# EAGLE design NIBB (EAGLE 8.1.0)
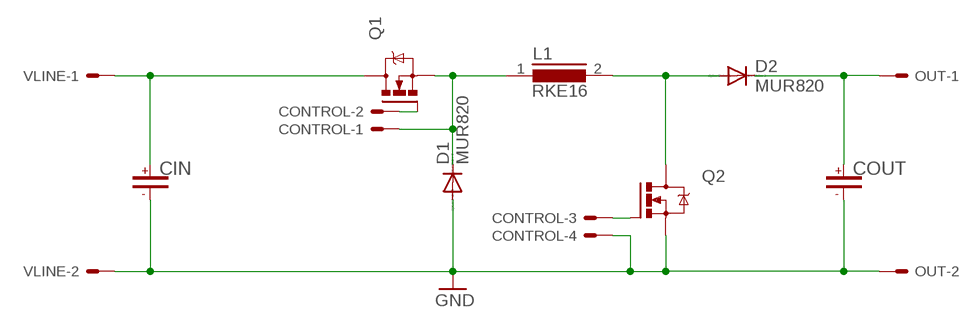
[diagram p0: schematic, sheet 1]

## Parts
CIN  CAPP-UF  [20ROUND40P]
CONTROL  22-23-2041  [22-23-2041]
COUT  CAPP-UF  [20ROUND40P]
D1  MUR820  [C221B1A]
D2  MUR820  [C221B1A]
L1  RKE16  [RKE16]
OUT  22-23-2021  [22-23-2021]
Q1  IRF640  [TO220BV]
Q2  IRF640  [TO220BV]
VLINE  22-23-2021  [22-23-2021]

## Nets
GND: CIN.- CONTROL.4 COUT.- D1.A OUT.2 Q2.S VLINE.2
N$1: CONTROL.1 D1.C L1.1 Q1.S
N$2: D2.A L1.2 Q2.D
N$3: CIN.+ Q1.D VLINE.1
N$4: CONTROL.2 Q1.G
N$5: CONTROL.3 Q2.G
N$7: COUT.+ D2.C OUT.1

## Library data of the parts
CIN COUT = capacitor:CAPP-U: Polarized capacitor, positive up; DESC: Capacitor, polarized
CONTROL = con-molex:22-23-2041: .100" (2.54mm) Center Header - 4 Pin; MF: MOLEX; MPN: 22-23-2041; OC_FARNELL: 1462920; OC_NEWARK: 38C0355
D1 D2 = diode:MUR820: DIODE
L1 = inductors:RKE16: INDUCTOR
OUT VLINE = con-molex:22-23-2021: .100" (2.54mm) Center Header - 2 Pin; MF: MOLEX; MPN: 22-23-2021; OC_FARNELL: 1462926; OC_NEWARK: 25C3832
Q1 Q2 = felippe:IRF640

## Board
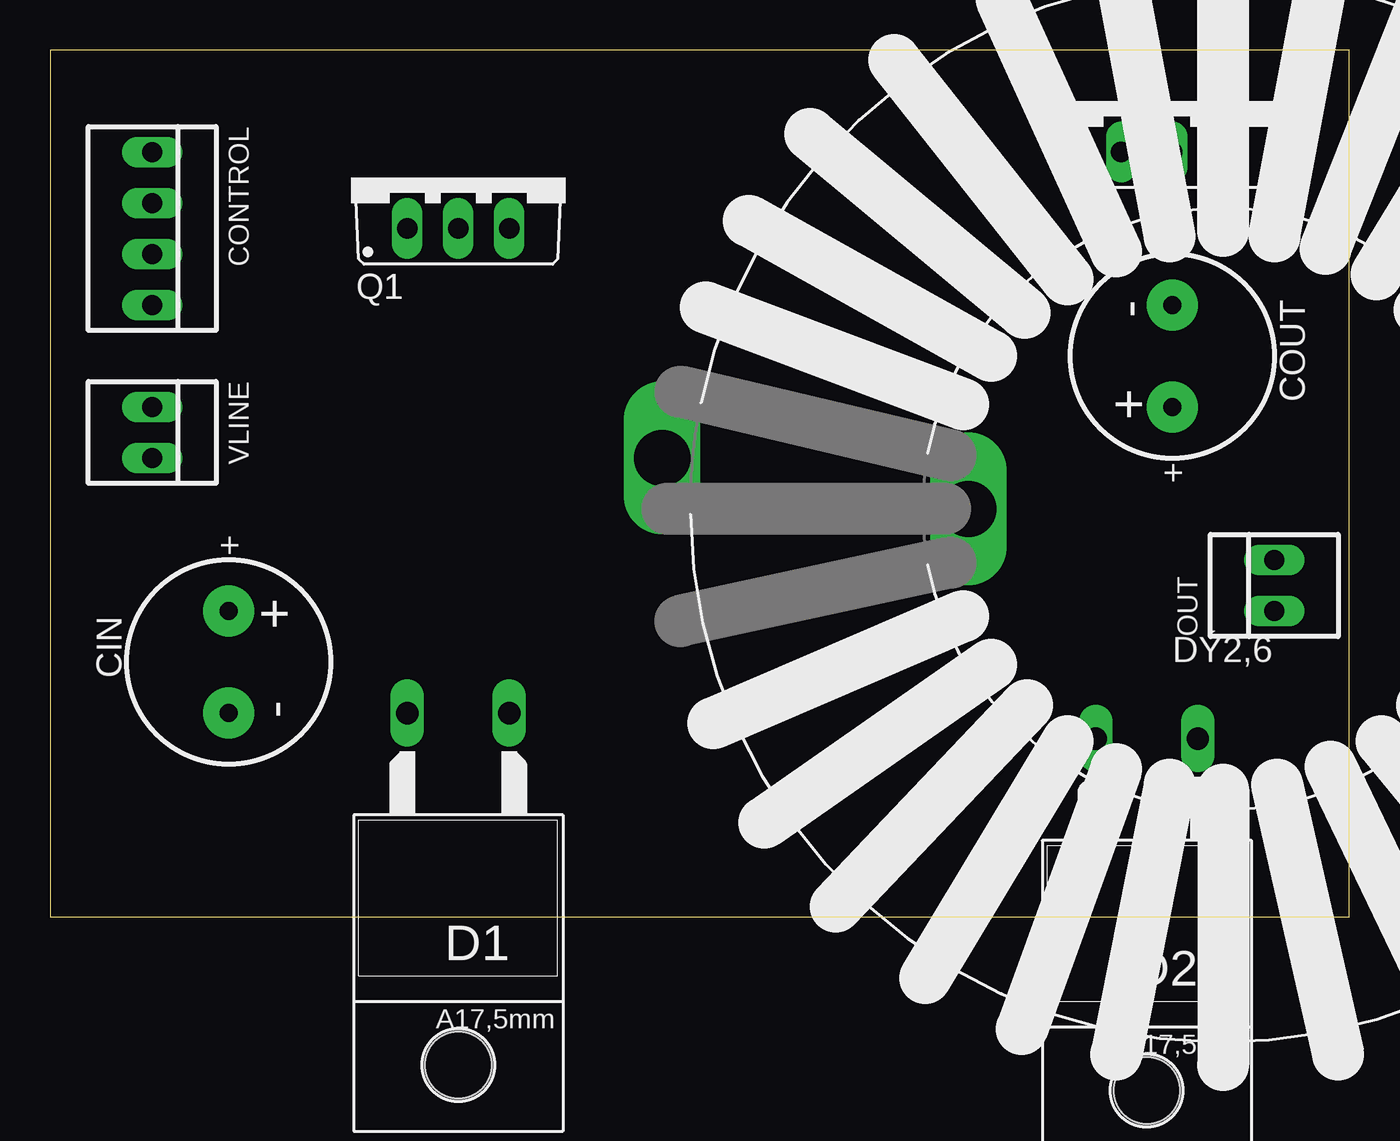
[diagram p1: board, top side]
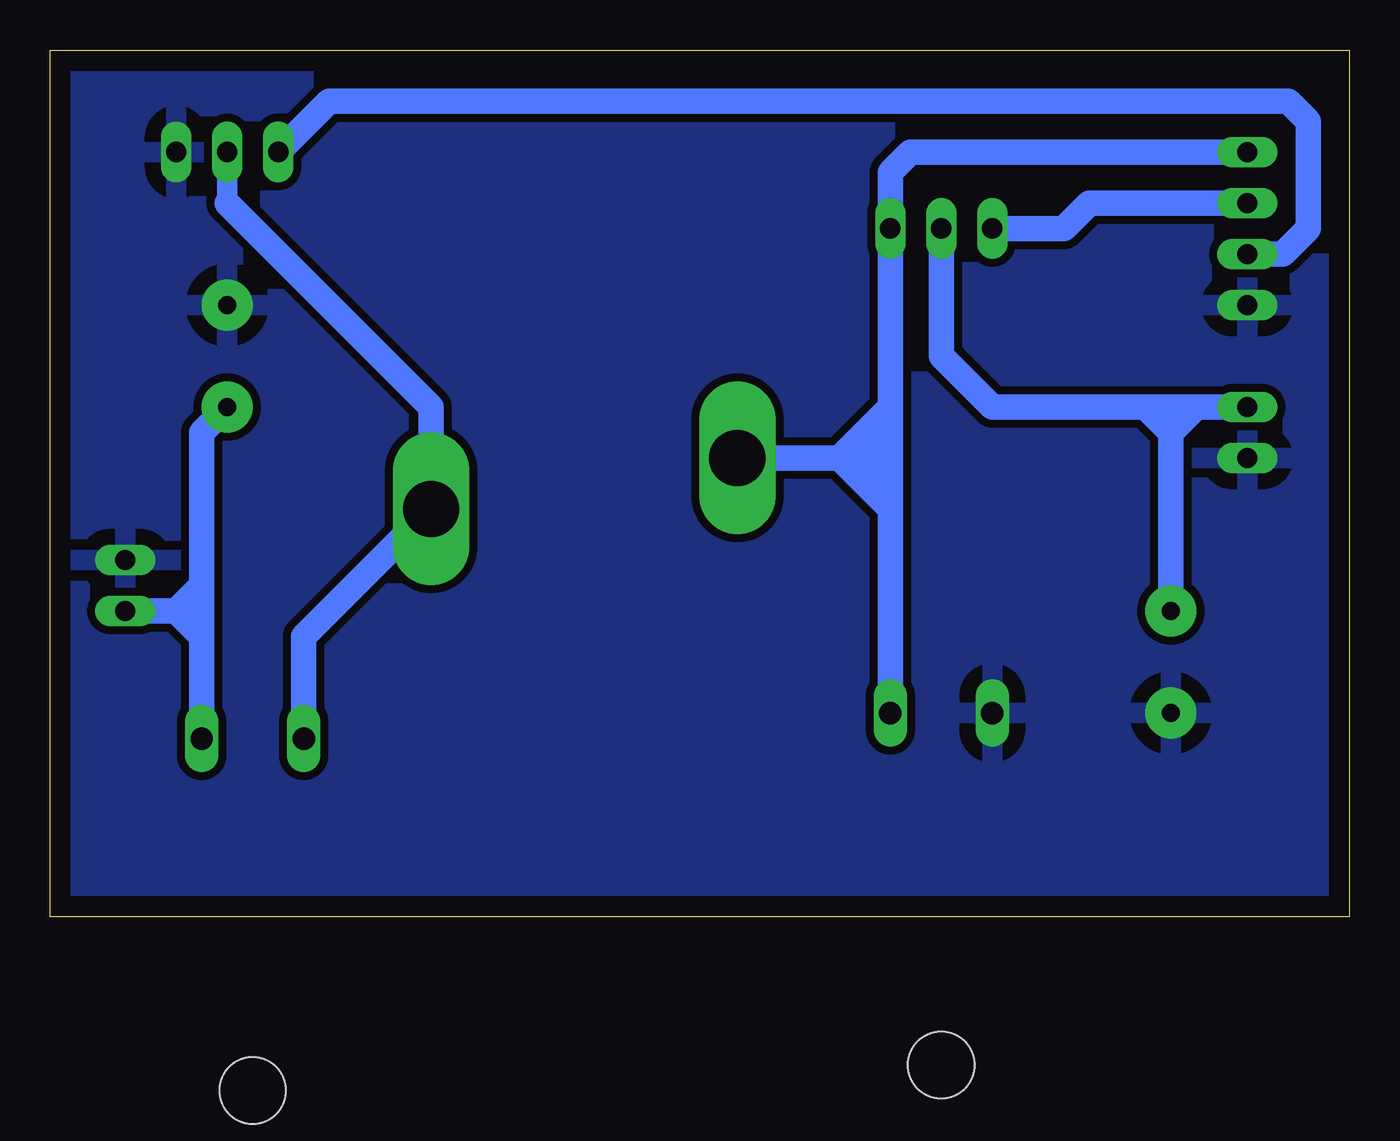
[diagram p2: board, bottom side, seen from below]

Size 64.69 x 43.17 mm. Coordinates in mm from the lower left corner, seen from the top.
Outline: 0,0 64.69,0 64.69,43.17 0,43.17 0,0
Copper layers (1*16): Top 0.035mm / dielectric 1.5mm / Bottom 0.035mm
Design rules "default *": minimum track width 0.8mm, minimum drill 0.8mm, track to track 0.4mm, track to pad 0.4mm, pad to pad 0.4mm, via to via 0.4mm, smd to smd 6mil, copper to edge 40mil, drill to drill 8mil, minimum pad ring 10mil, minimum via ring 8mil, stop-mask expansion 4mil, vias tented up to drill 0mil, thermal gap 0.8mm

### Footprints (pad centres in the part's own frame; a part is rotated, then mirrored left to right if it is on the bottom)
20ROUND40P = drill 0.889 pad 2.54: + -2.54,0; - 2.54,0
22-23-2041 = drill 1 long: 1 -3.81,0; 2 -1.27,0; 3 1.27,0; 4 3.81,0
C221B1A = drill 1.118 long: A 2.54,-6.35; C -2.54,-6.35 | hole 3.302: 0,11.176
RKE16 = drill 2.794 long: 1 -27.94,2.54; 2 -12.7,0
22-23-2021 = drill 1 long: 1 -1.27,0; 2 1.27,0
TO220BV = drill 1.016 long: D 0,-2.54; G -2.54,-2.54; S 2.54,-2.54

### Placement (x,y rotation side)
CIN  8.89,12.7 270 top
CONTROL  5.08,34.29 270 top
COUT  55.88,27.94 90 top
D1  20.32,3.81 180 top
D2  54.61,2.54 180 top
L1  58.42,20.32 0 top
OUT  60.96,16.51 90 top
Q1  20.32,36.83 0 top
Q2  55.88,40.64 0 top
VLINE  5.08,24.13 270 top

### Tracks (layer width: path | path; a pad name or v marks a point on that pad's centre or on a via)
GND
  pour Bottom (hatched): 0,43.18 64.77,43.18 64.77,0 0,0
N$1
  Bottom 1.27: 22.86,24.13 22.86,22.86 | 22.86,24.13 22.86,25.4 | 22.86,25.4 Q1.S 22.86,37.08 21.84,38.1 CONTROL.1 | 22.86,22.86 22.86,21.59 | 22.86,21.59 22.86,20.32 | 22.86,20.32 D1.C | 25.4,22.86 L1.1 | 25.4,22.86 24.13,22.86 | 24.13,22.86 22.86,22.86 | 22.86,20.32 25.4,22.86 | 22.86,25.4 25.4,22.86 | 22.86,21.59 24.13,22.86 | 24.13,22.86 22.86,24.13
N$2
  Bottom 1.016: Q2.D 55.88,35.56
  Bottom 1.27: 55.88,35.56 45.72,25.4 L1.2 52.07,13.97 D2.A
N$3
  Bottom 1.27: 7.62,25.4 8.89,25.4 | 7.62,25.4 VLINE.1 | 8.89,25.4 10.16,25.4 | CIN.+ 8.89,24.13 | 8.89,24.13 8.89,25.4 | 8.89,24.13 10.16,25.4 | 8.89,24.13 7.62,25.4 | 10.16,25.4 17.78,25.4 20.32,27.94 Q1.D
N$4
  Bottom 1.27: CONTROL.2 12.95,35.56 14.22,34.29 Q1.G
N$5
  Bottom 1.27: CONTROL.3 3.3,33.02 2.03,34.29 2.03,39.62 3.05,40.64 50.8,40.64 Q2.G
N$7
  Bottom 1.27: 57.15,13.97 57.15,15.24 | 57.15,13.97 D2.C | 57.15,16.51 57.15,15.24 | 57.15,16.51 57.15,24.13 COUT.+ | OUT.1 58.42,15.24 | 58.42,15.24 57.15,15.24 | 58.42,15.24 57.15,16.51 | 58.42,15.24 57.15,13.97